# EAGLE design Differenzverstärker_neu (EAGLE 9.6.2)

## Sheet 1 of 2: nflnafalf
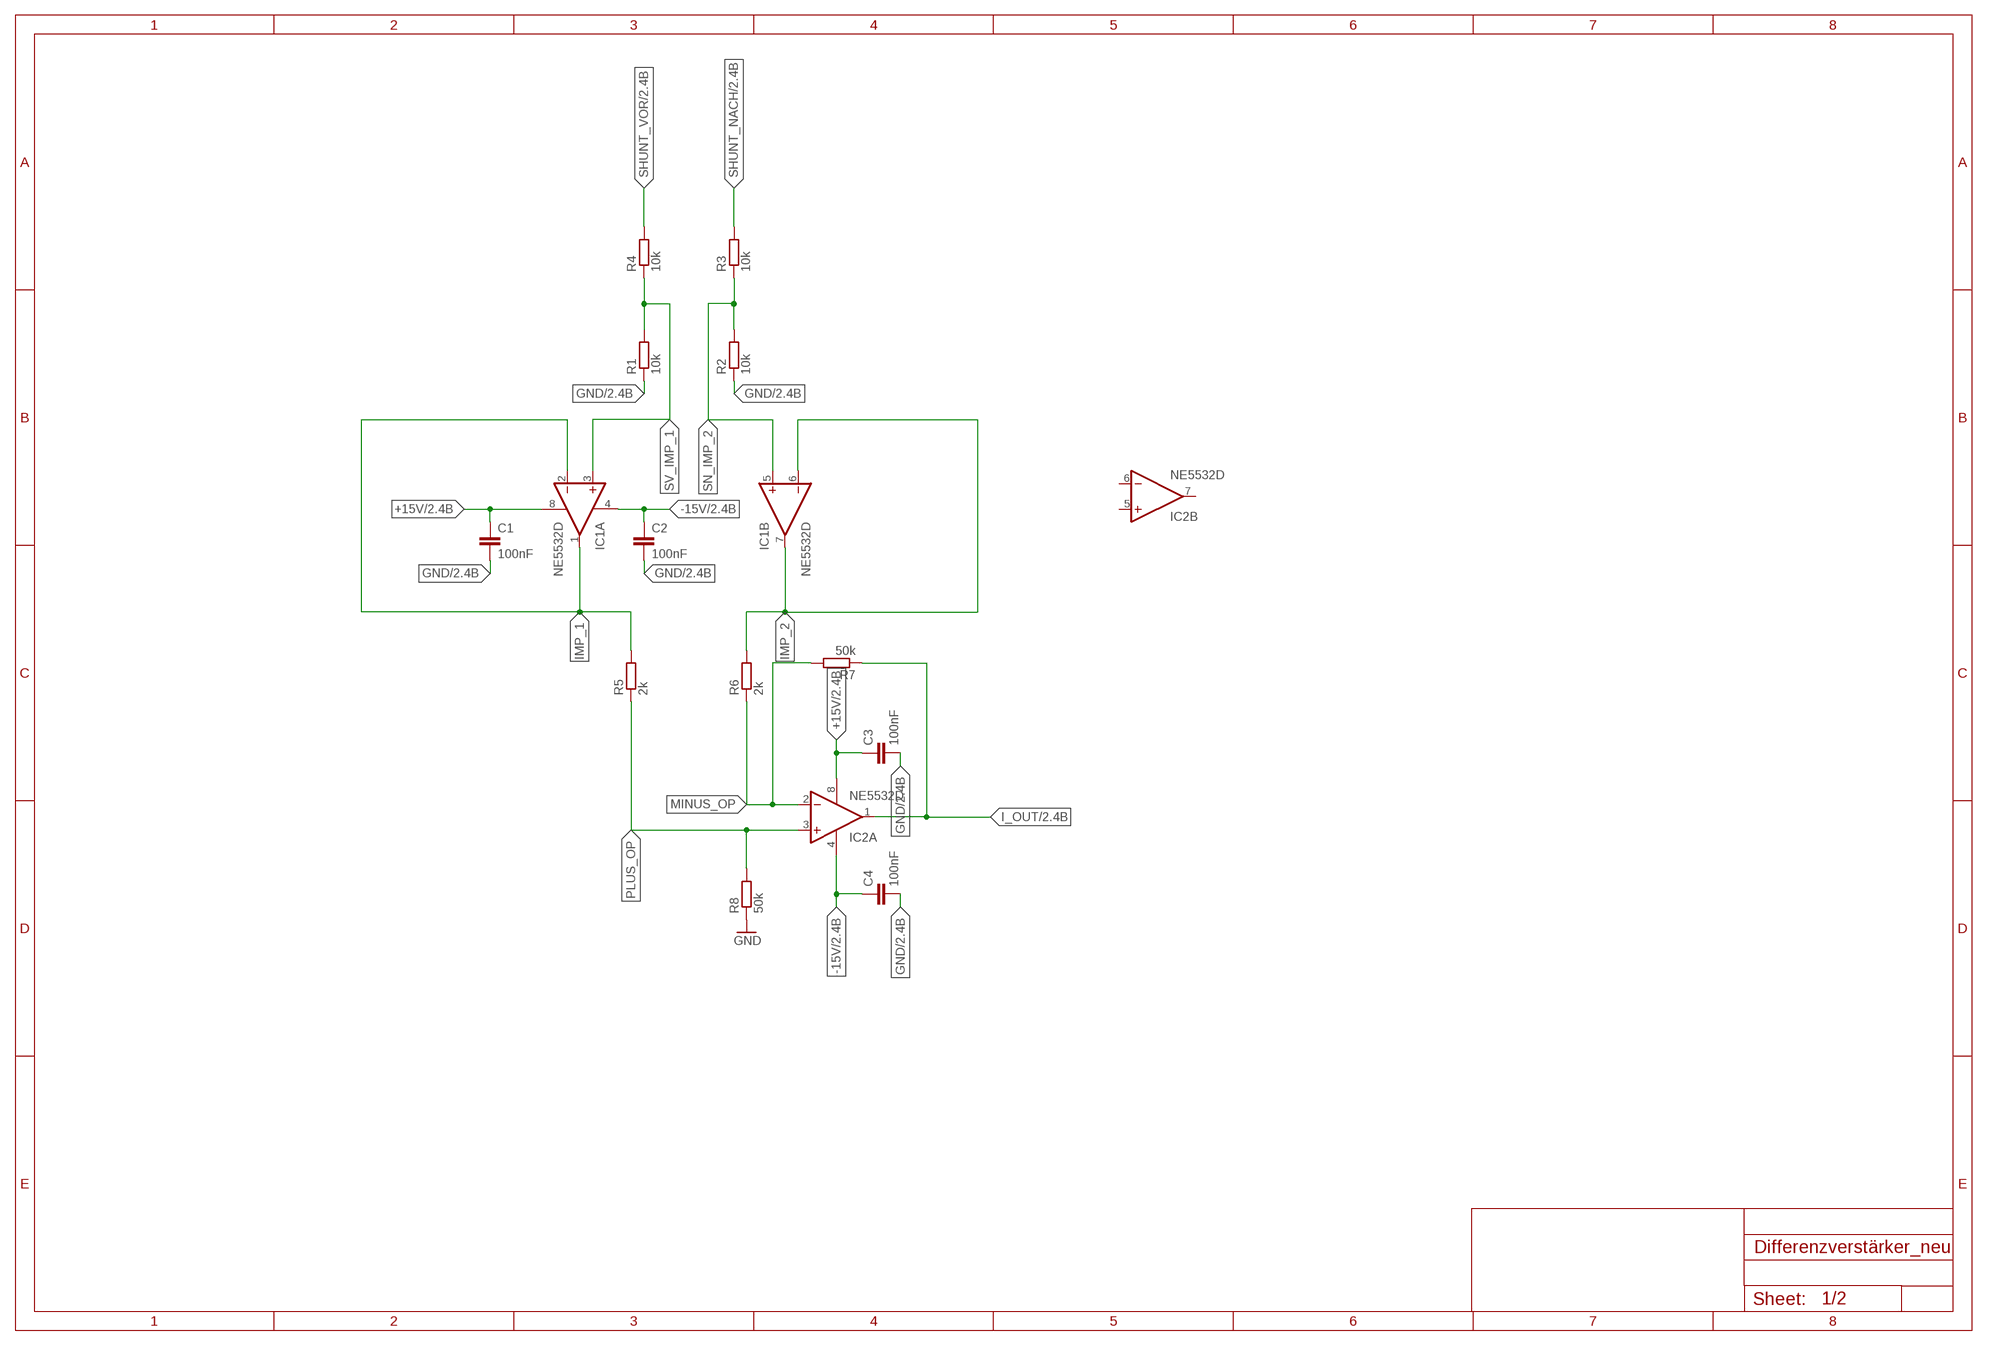
[diagram p0: schematic, sheet 1]

### Parts
C1  100nF  C-EUC0805  [C0805]
C2  100nF  C-EUC0805  [C0805]
C3  100nF  C-EUC0805  [C0805]
C4  100nF  C-EUC0805  [C0805]
IC1  NE5532D  [SO08]
IC2  NE5532D  [SO08]
R1  10k  R-EU_R0805  [R0805]
R2  10k  R-EU_R0805  [R0805]
R3  10k  R-EU_R0805  [R0805]
R4  10k  R-EU_R0805  [R0805]
R5  2k  R-EU_R0805  [R0805]
R6  2k  R-EU_R0805  [R0805]
R7  50k  R-EU_R0805  [R0805]
R8  50k  R-EU_R0805  [R0805]

### Nets
+15V: C1.1 C3.1 IC1.8(P:V+) IC2.8(P:V+) ; also sheet 2
-15V: C2.1 C4.1 IC1.4(P:V-) IC2.4(P:V-) ; also sheet 2
GND: C1.2 C2.2 C3.2 C4.2 R1.1 R2.1 R8.1 ; also sheet 2
I_OUT: IC2.1(A:OUT) R7.1 ; also sheet 2
IMP_1: IC1.1(A:OUT) IC1.2(A:-IN) R5.2
IMP_2: IC1.6(B:-IN) IC1.7(B:OUT) R6.2
MINUS_OP: IC2.2(A:-IN) R6.1 R7.2
PLUS_OP: IC2.3(A:+IN) R5.1 R8.2
SHUNT_NACH: R3.2 ; also sheet 2
SHUNT_VOR: R4.2 ; also sheet 2
SN_IMP_2: IC1.5(B:+IN) R2.2 R3.1
SV_IMP_1: IC1.3(A:+IN) R1.2 R4.1
Unconnected: IC2.5(B:+IN) IC2.6(B:-IN) IC2.7(B:OUT)

## Sheet 2 of 2
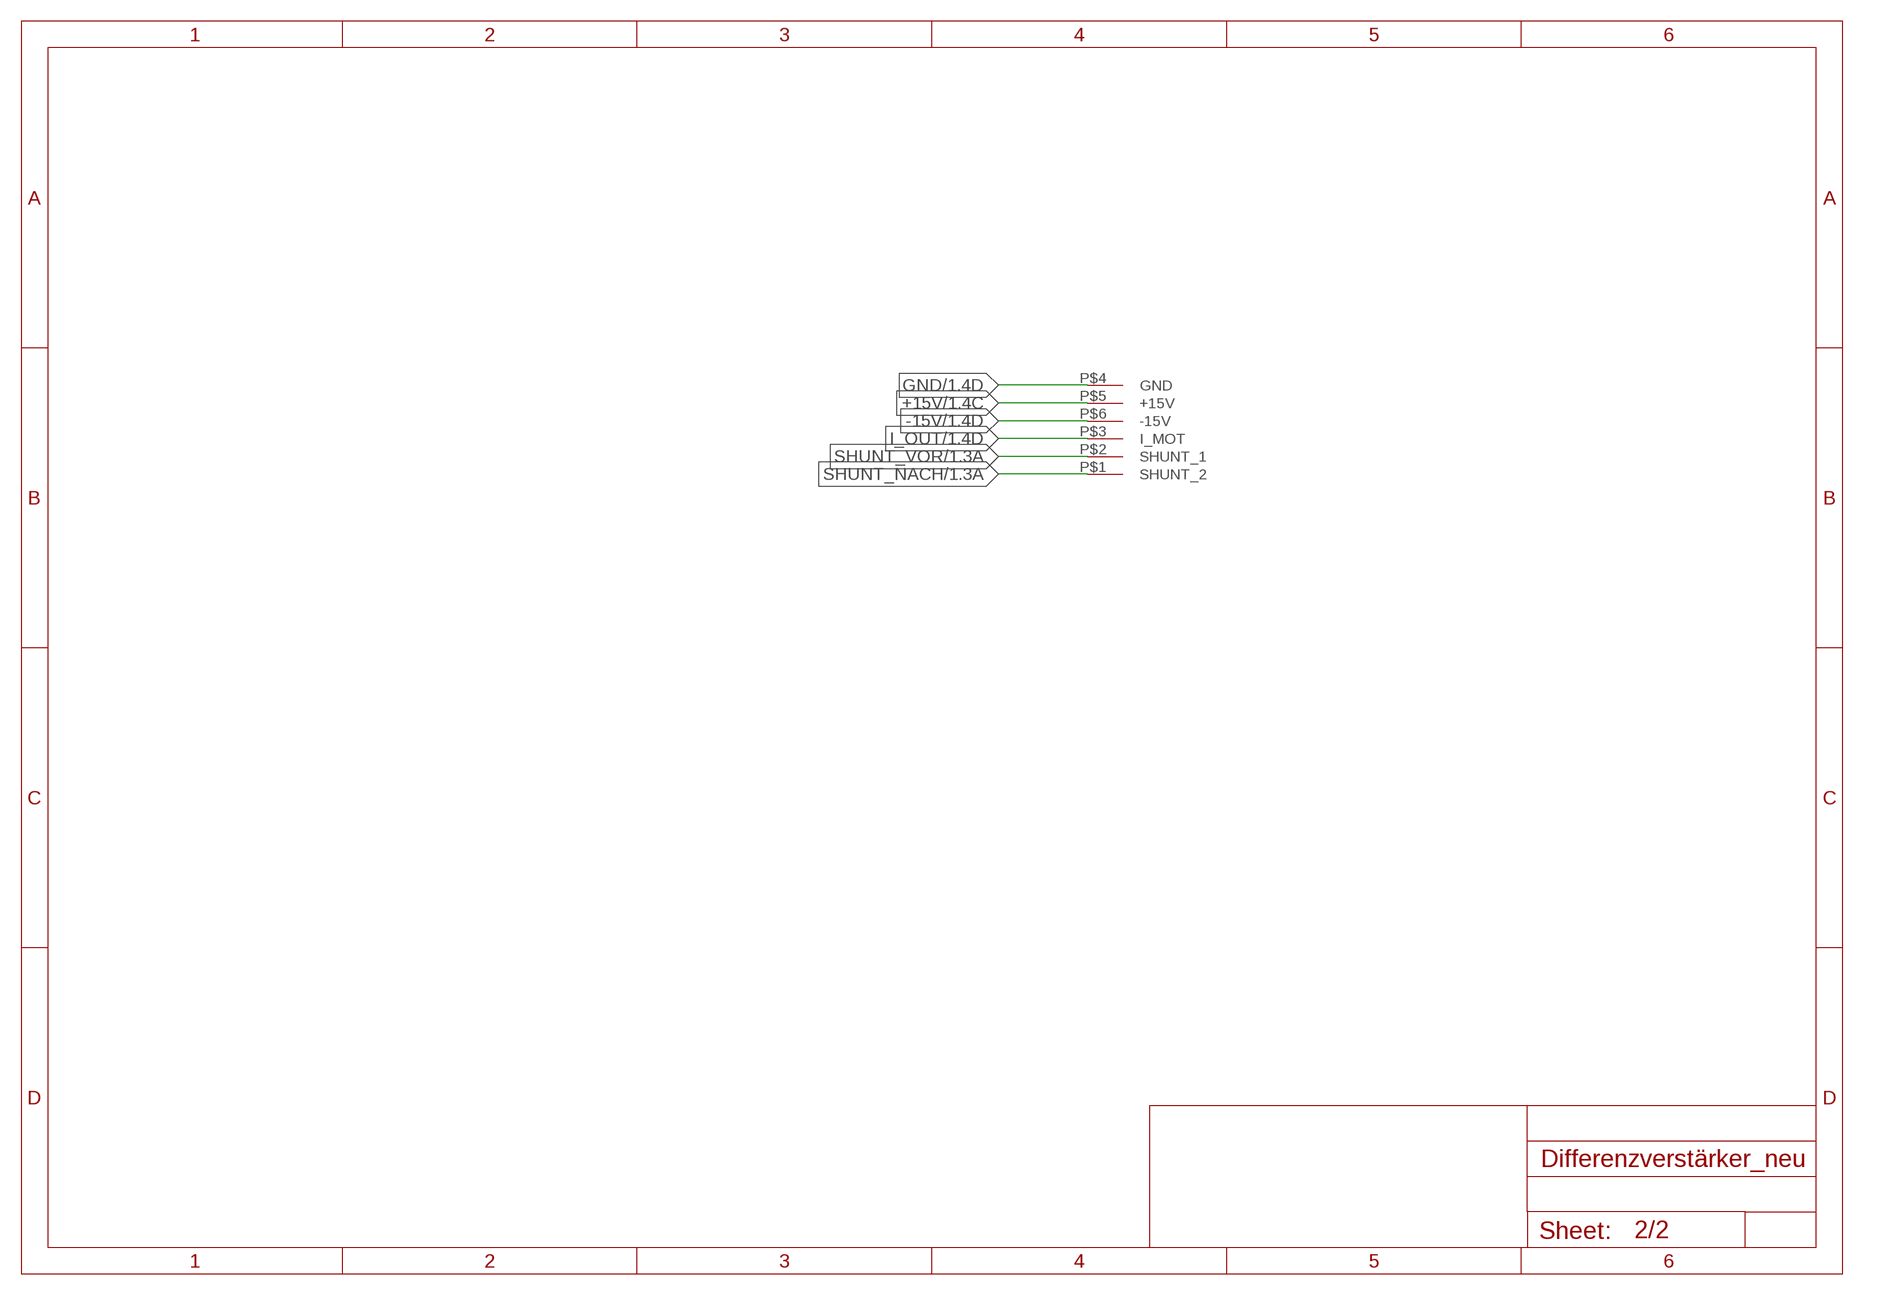
[diagram p1: schematic, sheet 2]

### Parts
U$2  ADAPTERPLATINE_OPSHUNT  [ADAPTERPLATINE_OPSHUNT]

### Nets
+15V: U$2.P$5(+15V) ; also sheet 1
-15V: U$2.P$6(-15V) ; also sheet 1
GND: U$2.P$4(GND) ; also sheet 1
I_OUT: U$2.P$3(I_MOT) ; also sheet 1
SHUNT_NACH: U$2.P$1(SHUNT_2) ; also sheet 1
SHUNT_VOR: U$2.P$2(SHUNT_1) ; also sheet 1

## Library data of the parts
C1-C4 = rcl:C-EU: CAPACITOR, European symbol; SPICEPREFIX: C
IC1 IC2 = linear:NE5532: AUDIO AMPLIFIER
R1-R8 = rcl:R-EU_: RESISTOR, European symbol; SPICEPREFIX: R
U$2 = Adapterplatine_OPShunt:ADAPTERPLATINE_OPSHUNT

## Net classes
0 default: width 0.61 mm, clearance 0.305 mm

## Board
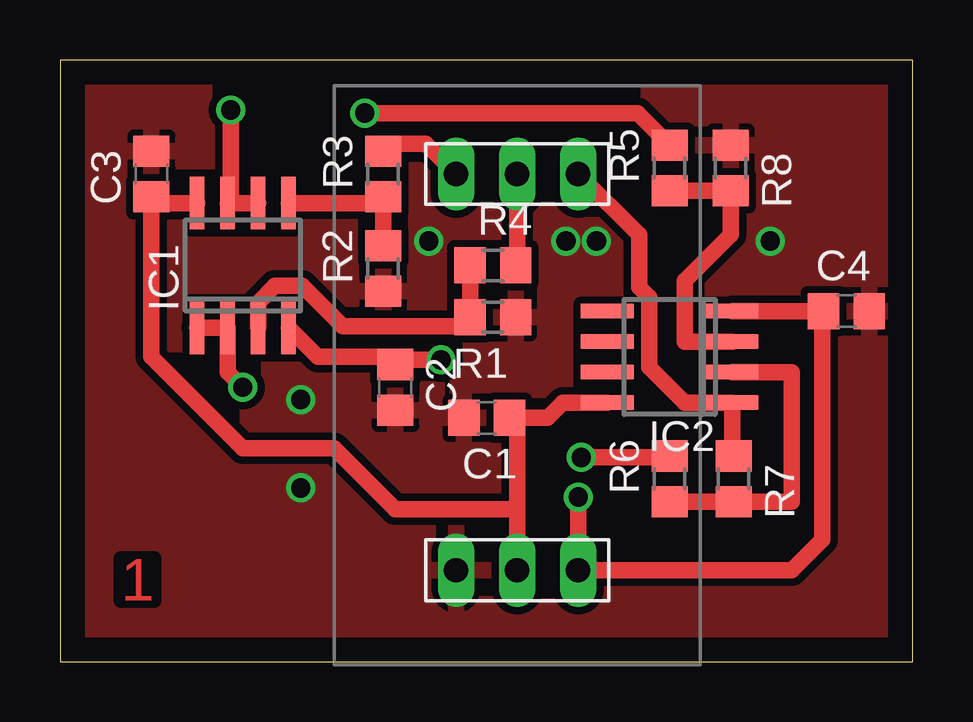
[diagram p2: board, top side]
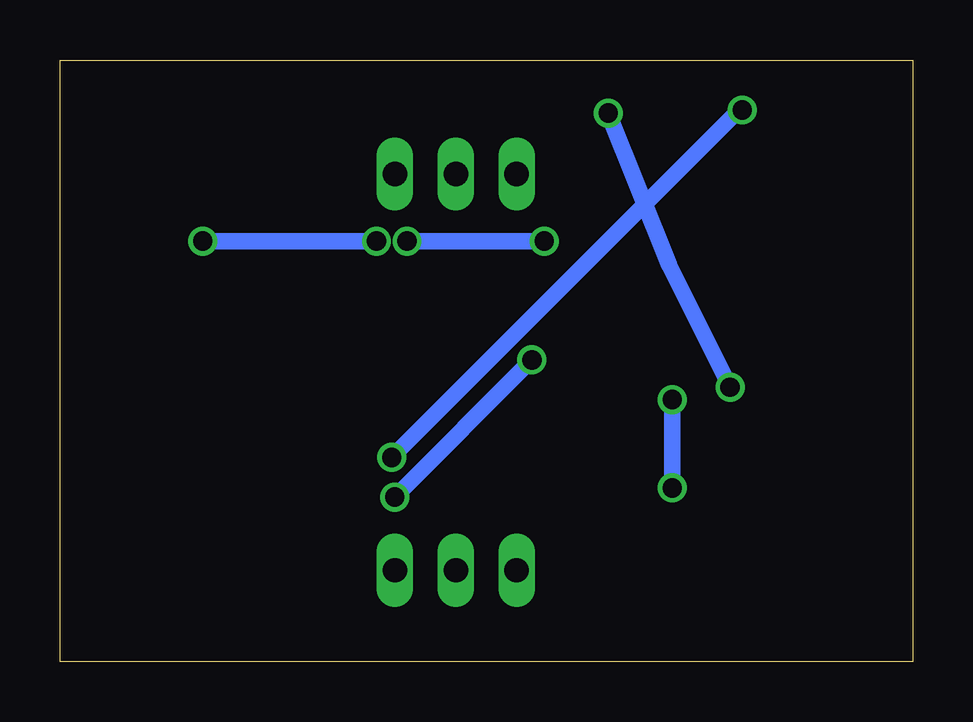
[diagram p3: board, bottom side, seen from below]

Size 35.54 x 25.07 mm. Coordinates in mm from the lower left corner, seen from the top.
Outline: 0,0 35.54,0 35.54,25.07 0,25.07 0,0
Copper layers (1*16): Top 0.035mm / dielectric 1.5mm / Bottom 0.035mm
Design rules "default *": minimum track width 0.696mm, minimum drill 0.35mm, track to track 6mil, track to pad 6mil, pad to pad 6mil, via to via 6mil, smd to smd 6mil, copper to edge 40mil, drill to drill 6mil, minimum pad ring 10mil, minimum via ring 8mil, stop-mask expansion 4mil, vias tented up to drill 0mil, thermal gap 10mil

### Footprints (pad centres in the part's own frame; a part is rotated, then mirrored left to right if it is on the bottom)
C0805 = smd 1.3 x 1.5: 1 -0.95,0; 2 0.95,0
SO08 = smd 0.6 x 2.2: 1 -1.905,-2.6; 2 -0.635,-2.6; 3 0.635,-2.6; 4 1.905,-2.6; 5 1.905,2.6; 6 0.635,2.6; 7 -0.635,2.6; 8 -1.905,2.6
R0805 = smd 1.3 x 1.5: 1 -0.95,0; 2 0.95,0
ADAPTERPLATINE_OPSHUNT = drill 1.02 long: P$1 0,3.81; P$2 2.54,3.81; P$3 5.08,3.81; P$4 0,-12.7; P$5 2.54,-12.7; P$6 5.08,-12.7

### Placement (x,y rotation side)
C1  17.78,10.16 180 top
C2  13.97,11.43 270 top
C3  3.81,20.32 90 top
C4  32.77,14.61 0 top
IC1  7.62,16.51 0 top
IC2  25.4,12.7 90 top
R1  18.03,14.35 180 top
R2  13.46,16.38 90 top
R3  13.46,20.32 90 top
R4  18.03,16.51 0 top
R5  25.4,20.57 90 top
R6  25.4,7.62 90 top
R7  28.07,7.62 270 top
R8  27.94,20.57 270 top
U$2  16.51,16.51 0 top

### Tracks (layer width: path | path; a pad name or v marks a point on that pad's centre or on a via)
+15V
  Top 0.696: 19.05,6.35 13.97,6.35 11.43,8.89 7.62,8.89 3.81,12.7 C3.1 4.07,19.11 IC1.8 | U$2.P$5 19.05,6.35 | 19.05,6.35 19.05,9.84 C1.1 20.32,10.16 20.95,10.8 IC2.8
-15V  (via drill 0.8)
  Top 0.696: IC1.4 10.73,12.7 13.65,12.7 C2.1 14.16,12.57 v15.88,12.57 | IC2.4 C4.1 31.75,14.54 31.75,5.08 30.48,3.81 U$2.P$6 v21.59,6.86
  Bottom 0.696: v21.59,6.86 v15.88,12.57
GND  (via drill 0.8)
  Bottom 0.696: v10.03,10.92 v10.03,7.24 | v22.35,17.53 v29.59,17.53 | v15.37,17.53 v21.08,17.53
  pour Top: -5.08,-6.35 39.37,-6.35 39.37,29.21 -5.08,29.21
I_OUT
  Top 0.696: R7.1 28,8.64 IC2.1 26.03,10.8 24.55,12.28 24.55,15.17 24.13,15.6 24.13,17.78 U$2.P$3
IMP_1  (via drill 0.8)
  Top 0.696: IC1.1 IC1.2 6.98,12.06 v7.62,11.43 | v12.7,22.86 24.06,22.86 R5.2
  Bottom 0.696: v7.62,11.43 10.16,16.51 v12.7,22.86
IMP_2  (via drill 0.8)
  Top 0.696: IC1.6 IC1.7 7.11,19.24 v7.11,22.99 | v21.72,8.51 25.34,8.51 R6.2
  Bottom 0.696: v21.72,8.51 7.24,22.99 v7.11,22.99
MINUS_OP
  Top 0.696: R6.1 R7.2 30.48,6.67 30.48,12.06 IC2.2
PLUS_OP
  Top 0.696: IC2.3 26.03,13.34 26.03,15.88 27.94,17.78 R8.2 R5.1
SHUNT_NACH
  Top 0.696: U$2.P$1 15.24,21.59 13.78,21.59 R3.2
SHUNT_VOR
  Top 0.696: U$2.P$2 19.05,16.58 R4.2
SN_IMP_2
  Top 0.696: R2.2 R3.1 13.2,19.11 IC1.5
SV_IMP_1
  Top 0.696: R4.1 R1.2 16.7,13.97 11.79,13.97 10.09,15.66 8.95,15.66 8.26,14.96 IC1.3

### Text on the board
Top: 1